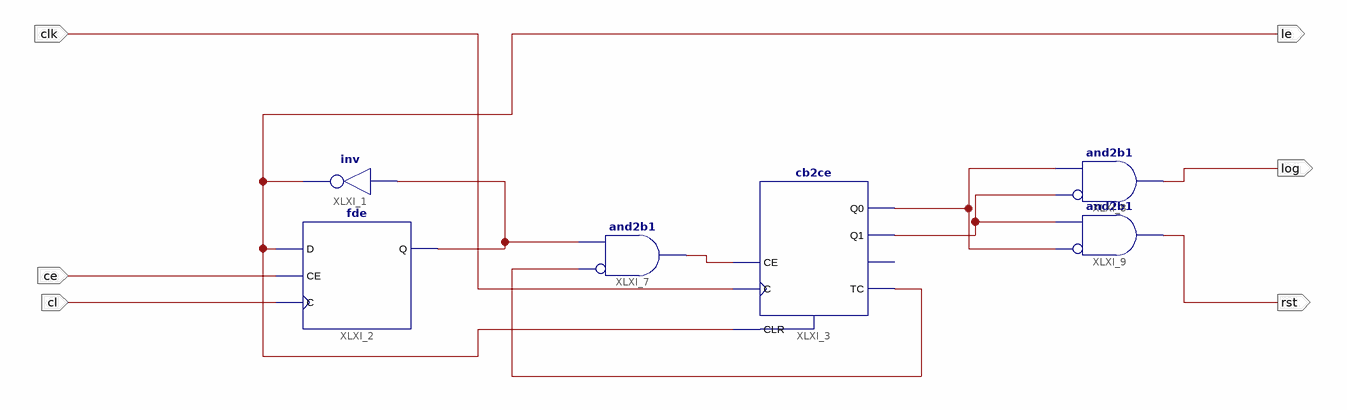
[diagram p0: schematic sheet 1]
// Xilinx ISE schematic counterlogic.sch (spartan3e) as structural Verilog: 6 symbols, 6 ports
module counterlogic (
  input  clk,
  input  cl,
  input  ce,
  output le,
  output rst,
  output log
);

  wire XLXN_4, XLXN_6, XLXN_18, XLXN_19, XLXN_22;

  not XLXI_1 (le, XLXN_22);
  fde XLXI_2 (.C(cl), .CE(ce), .D(le), .Q(XLXN_22));
  cb2ce XLXI_3 (.C(clk), .CE(XLXN_4), .CLR(le), .Q0(XLXN_19), .Q1(XLXN_18), .TC(XLXN_6));  // open: CEO
  and XLXI_7 (XLXN_4, ~XLXN_6, XLXN_22);  // and2b1
  and XLXI_9 (rst, ~XLXN_19, XLXN_18);  // and2b1
  and XLXI_8 (log, ~XLXN_18, XLXN_19);  // and2b1
endmodule
